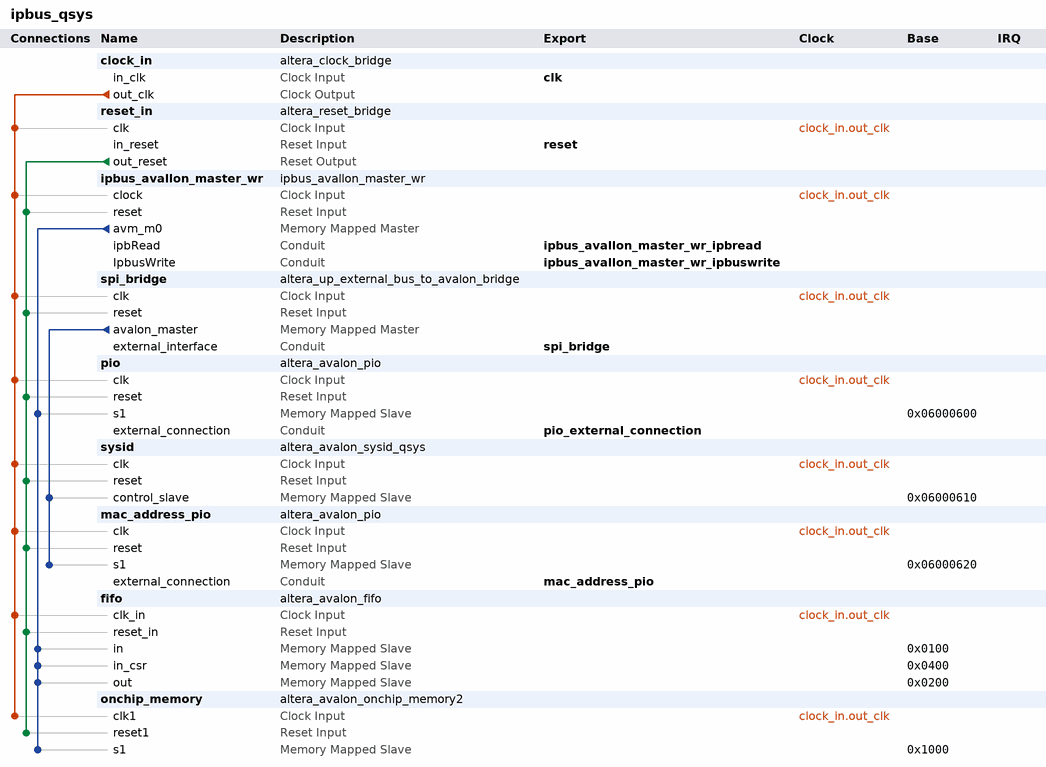
[diagram p0: system contents]
# Platform Designer (Qsys) system ipbus_qsys, Arria 10 10AS016C3U19E2LG
# Parameters at their usual value, and those the tool derives, are not listed.
package require -exact qsys 1.0
create_system ipbus_qsys
set_project_property DEVICE_FAMILY {Arria 10}
set_project_property DEVICE 10AS016C3U19E2LG

add_component clock_in ip/ipbus_qsys_clock_in.ip altera_clock_bridge clock_in 19.1

add_component reset_in ip/ipbus_qsys_reset_in.ip altera_reset_bridge reset_in 19.1

add_component ipbus_avallon_master_wr ip/ipbus_qsys_ipbus_avallon_master_wr.ip ipbus_avallon_master_wr ipbus_avallon_master_wr 1.0

add_component spi_bridge ip/ipbus_qsys_spi_bridge.ip altera_up_external_bus_to_avalon_bridge spi_bridge 18.0

add_component pio ip/ipbus_qsys_pio.ip altera_avalon_pio pio 19.1

add_component sysid ip/ipbus_qsys_sysid.ip altera_avalon_sysid_qsys sysid 19.1

add_component mac_address_pio ip/ipbus_qsys_mac_address_pio.ip altera_avalon_pio mac_address_pio 19.1

add_component fifo ip/ipbus_qsys_fifo.ip altera_avalon_fifo fifo 19.1

add_component onchip_memory ip/ipbus_qsys_onchip_memory.ip altera_avalon_onchip_memory2 onchip_memory 19.1

# connections
add_connection clock_in.out_clk fifo.clk_in clock
add_connection clock_in.out_clk ipbus_avallon_master_wr.clock clock
add_connection clock_in.out_clk mac_address_pio.clk clock
add_connection clock_in.out_clk onchip_memory.clk1 clock
add_connection clock_in.out_clk pio.clk clock
add_connection clock_in.out_clk reset_in.clk clock
add_connection clock_in.out_clk spi_bridge.clk clock
add_connection clock_in.out_clk sysid.clk clock
add_connection reset_in.out_reset fifo.reset_in reset
add_connection reset_in.out_reset ipbus_avallon_master_wr.reset reset
add_connection reset_in.out_reset mac_address_pio.reset reset
add_connection reset_in.out_reset onchip_memory.reset1 reset
add_connection reset_in.out_reset pio.reset reset
add_connection reset_in.out_reset spi_bridge.reset reset
add_connection reset_in.out_reset sysid.reset reset
add_connection ipbus_avallon_master_wr.avm_m0 fifo.in avalon
set_connection_parameter_value ipbus_avallon_master_wr.avm_m0/fifo.in baseAddress 0x0100
add_connection ipbus_avallon_master_wr.avm_m0 fifo.in_csr avalon
set_connection_parameter_value ipbus_avallon_master_wr.avm_m0/fifo.in_csr baseAddress 0x0400
add_connection ipbus_avallon_master_wr.avm_m0 fifo.out avalon
set_connection_parameter_value ipbus_avallon_master_wr.avm_m0/fifo.out baseAddress 0x0200
add_connection ipbus_avallon_master_wr.avm_m0 onchip_memory.s1 avalon
set_connection_parameter_value ipbus_avallon_master_wr.avm_m0/onchip_memory.s1 baseAddress 0x1000
add_connection ipbus_avallon_master_wr.avm_m0 pio.s1 avalon
set_connection_parameter_value ipbus_avallon_master_wr.avm_m0/pio.s1 baseAddress 0x06000600
add_connection spi_bridge.avalon_master mac_address_pio.s1 avalon
set_connection_parameter_value spi_bridge.avalon_master/mac_address_pio.s1 baseAddress 0x06000620
add_connection spi_bridge.avalon_master sysid.control_slave avalon
set_connection_parameter_value spi_bridge.avalon_master/sysid.control_slave baseAddress 0x06000610

# exported interfaces
add_interface clk clock sink
set_interface_property clk EXPORT_OF clock_in.in_clk
add_interface ipbus_avallon_master_wr_ipbread conduit end
set_interface_property ipbus_avallon_master_wr_ipbread EXPORT_OF ipbus_avallon_master_wr.ipbRead
add_interface ipbus_avallon_master_wr_ipbuswrite conduit end
set_interface_property ipbus_avallon_master_wr_ipbuswrite EXPORT_OF ipbus_avallon_master_wr.IpbusWrite
add_interface mac_address_pio conduit end
set_interface_property mac_address_pio EXPORT_OF mac_address_pio.external_connection
add_interface pio_external_connection conduit end
set_interface_property pio_external_connection EXPORT_OF pio.external_connection
add_interface reset reset sink
set_interface_property reset EXPORT_OF reset_in.in_reset
add_interface spi_bridge conduit end
set_interface_property spi_bridge EXPORT_OF spi_bridge.external_interface

save_system ipbus_qsys.qsys
